# EAGLE board Arctos 65 V1 (EAGLE 9.6.2)
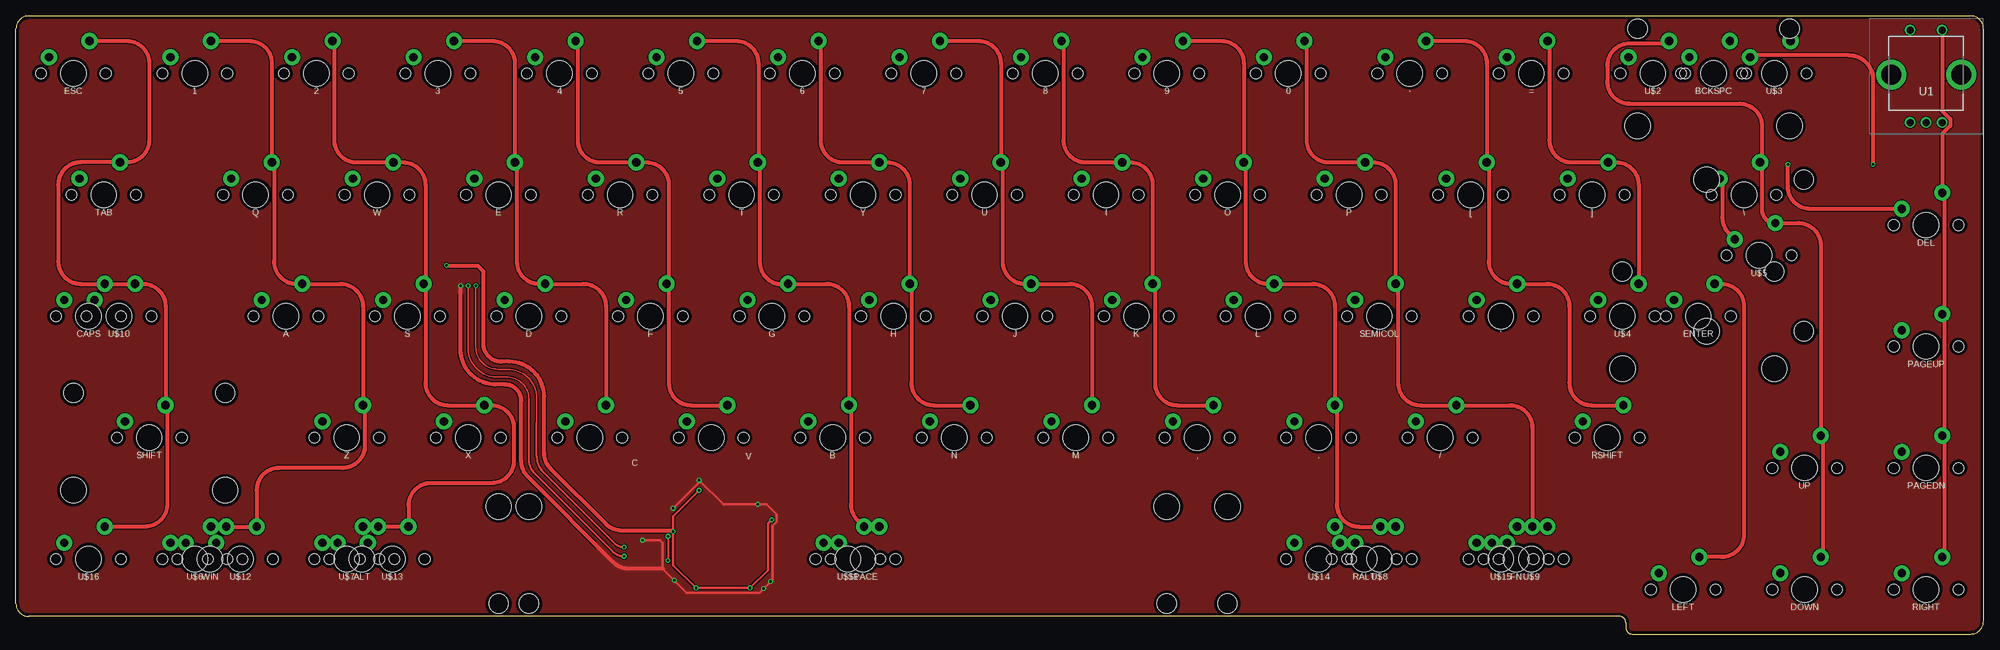
[diagram p2: board, top side]
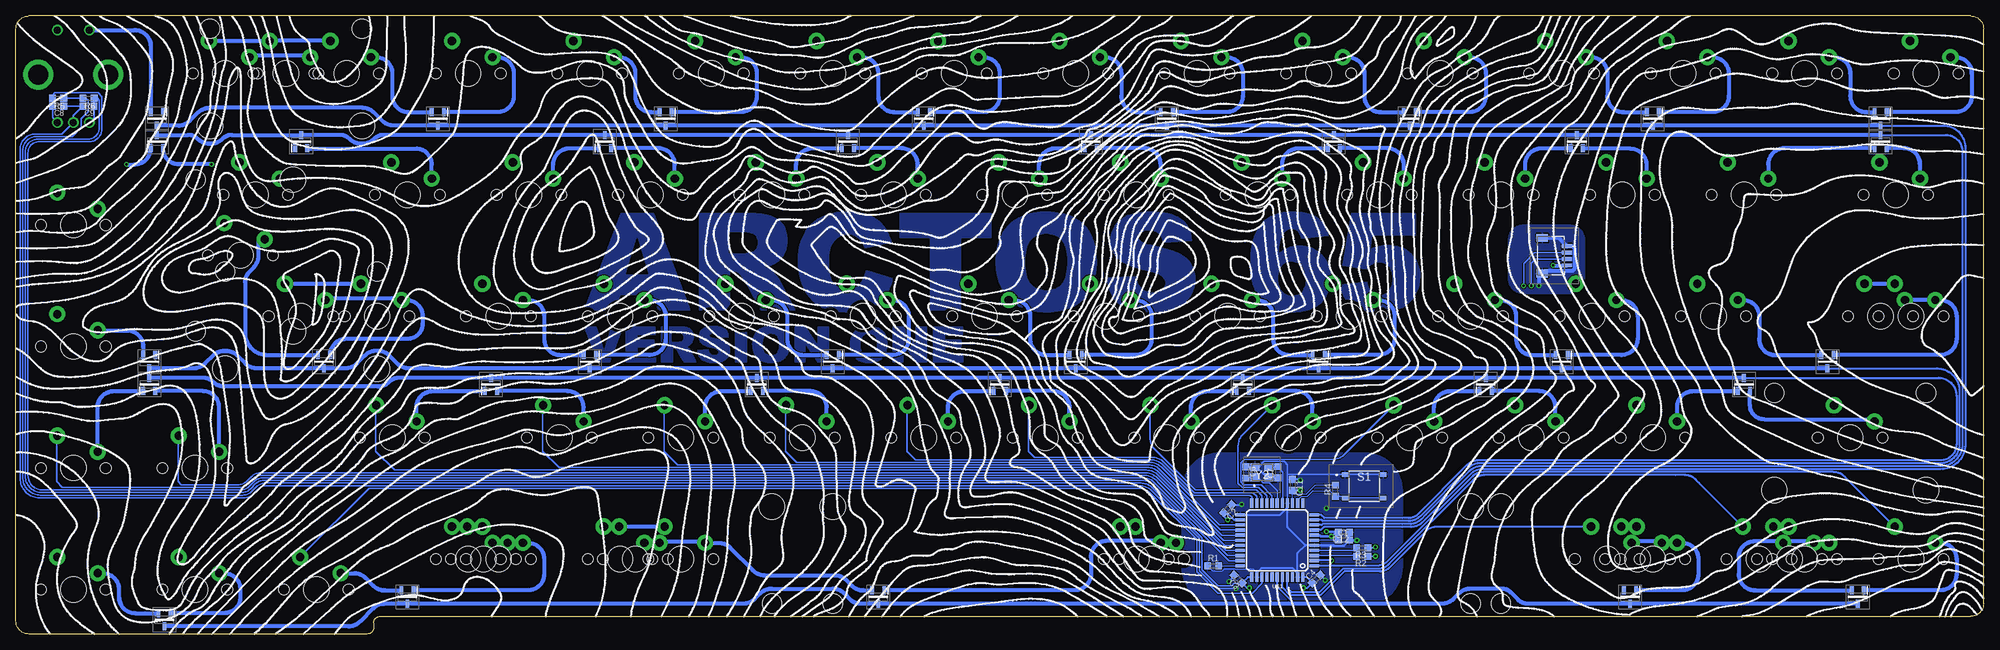
[diagram p3: board, bottom side, seen from below]

Size 308.51 x 96.96 mm. Coordinates in mm from the lower left corner, seen from the top.
Outline: 2,96.96 arc90 0,94.96
Outline: 308.51,94.96 arc90 306.51,96.96
Outline: 306.51,0 arc90 308.51,2
Outline: 0,4.76 arc90 2,2.76
Outline: 252.41,1.76 arc90 251.41,2.76
Outline: 252.41,1 arc90 253.41,0
Outline: 0,4.76 0,94.96
Outline: 308.51,2 308.51,94.96
Outline: 2,96.96 306.51,96.96
Outline: 2,96.96 arc90 0,94.96
Outline: 308.51,94.96 arc90 306.51,96.96
Outline: 251.41,2.76 2,2.76
Outline: 252.41,1.76 252.41,1
Outline: 306.51,0 arc90 308.51,2
Outline: 0,4.76 arc90 2,2.76
Outline: 252.41,1.76 arc90 251.41,2.76
Outline: 252.41,1 arc90 253.41,0
Outline: 253.41,0 306.51,0
Copper layers (1*16): Top 0.035mm / dielectric 1.5mm / Bottom 0.035mm
Design rules "default *": minimum track width 6mil, minimum drill 0.35mm, track to track 6mil, track to pad 6mil, pad to pad 6mil, via to via 6mil, smd to smd 6mil, copper to edge 20mil, drill to drill 6mil, minimum pad ring 10mil, minimum via ring 8mil, stop-mask expansion 4mil, vias tented up to drill 0mil, thermal gap 10mil

## Footprints (pad centres in the part's own frame; a part is rotated, then mirrored left to right if it is on the bottom)
MX-1U = drill 1.3 pad 2.54: MX1 -3.81,2.54; MX2 2.54,5.08 | hole 4: 0,0 | hole 1.7: -5.08,0; 5.08,0
MX-2U = drill 1.3 pad 2.54: MX1 -3.81,2.54; MX2 2.54,5.08 | hole 4: 0,0; -11.9,-8.24; 11.9,-8.24 | hole 1.7: -5.08,0; 5.08,0 | hole 3.05: -11.9,7; 11.9,7
C0603 = smd 1.05 x 1.08: 1 -0.875,0; 2 0.875,0
SOT96P237X111-3N = smd 1.25 x 0.6: 1 -1.05,0.955; 2 -1.05,-0.955; 3 1.05,0
1014760600004LF = smd 0.6 x 1.55: 1 -1.5,2; 2 -0.5,2; 3 0.5,2; 4 1.5,2 | smd 1.2 x 1.8: 5 -2.8,-1.875; 6 2.8,-1.875
R0603 = smd 1.05 x 1.08: 1 -0.875,0; 2 0.875,0
PTS526SM08SMTR2LFS = smd 1 x 0.7: 1 -3,1.85; 2 3,1.85; 3 -3,-1.85; 4 3,-1.85
MX-7U-FLIPPED = drill 1.3 pad 2.54: MX1 -3.81,2.54; MX2 2.54,5.08 | hole 4: 0,0; -57.15,8.24; 57.15,8.24 | hole 1.7: -5.08,0; 5.08,0 | hole 3.05: -57.15,-7; 57.15,-7
EC11E183440C = drill 1.1 pad 1.65: A1 0,0; B1 5,0; C1 2.5,0; D1 0,14.5; E1 5,14.5 | drill 3.139 pad 4.708: MH1 -3,7.5; MH2 8,7.5
TQFP44 = smd 1.5 x 0.5: 1 -5.8,4; 2 -5.8,3.2; 3 -5.8,2.4; 4 -5.8,1.6; 5 -5.8,0.8; 6 -5.8,0; 7 -5.8,-0.8; 8 -5.8,-1.6; 9 -5.8,-2.4; 10 -5.8,-3.2; 11 -5.8,-4; 23 5.8,-4; 24 5.8,-3.2; 25 5.8,-2.4; 26 5.8,-1.6; 27 5.8,-0.8; 28 5.8,0; 29 5.8,0.8; 30 5.8,1.6; 31 5.8,2.4; 32 5.8,3.2; 33 5.8,4 | smd 0.5 x 1.5: 12 -4,-5.8; 13 -3.2,-5.8; 14 -2.4,-5.8; 15 -1.6,-5.8; 16 -0.8,-5.8; 17 0,-5.8; 18 0.8,-5.8; 19 1.6,-5.8; 20 2.4,-5.8; 21 3.2,-5.8; 22 4,-5.8; 34 4,5.8; 35 3.2,5.8; 36 2.4,5.8; 37 1.6,5.8; 38 0.8,5.8; 39 0,5.8; 40 -0.8,5.8; 41 -1.6,5.8; 42 -2.4,5.8; 43 -3.2,5.8; 44 -4,5.8
MX-2U-ROTATED = drill 1.3 pad 2.54: MX1 -3.81,2.54; MX2 2.54,5.08 | hole 4: 0,0; -8.24,-11.9; -8.24,11.9 | hole 1.7: -5.08,0; 5.08,0 | hole 3.05: 7,-11.9; 7,11.9
MX-6.25U-FLIPPED = drill 1.3 pad 2.54: MX1 -3.81,2.54; MX2 2.54,5.08 | hole 4: 0,0; -50,8.24; 50,8.24 | hole 1.7: -5.08,0; 5.08,0 | hole 3.05: -50,-7; 50,-7
ABM8AIG16000MHZ81ZT = smd 1.4 x 1.2: 1 -1.1,-0.8; 2 1.1,-0.8; 3 1.1,0.8; 4 -1.1,0.8

## Placement (x,y rotation side)
0  KEYSWITCH-PLAIN-MX-1U  [MX-1U]  199.5,87.96 0 top
1  KEYSWITCH-PLAIN-MX-1U  [MX-1U]  28.05,87.96 0 top
2  KEYSWITCH-PLAIN-MX-1U  [MX-1U]  47.1,87.96 0 top
3  KEYSWITCH-PLAIN-MX-1U  [MX-1U]  66.15,87.96 0 top
4  KEYSWITCH-PLAIN-MX-1U  [MX-1U]  85.2,87.96 0 top
5  KEYSWITCH-PLAIN-MX-1U  [MX-1U]  104.25,87.96 0 top
6  KEYSWITCH-PLAIN-MX-1U  [MX-1U]  123.3,87.96 0 top
7  KEYSWITCH-PLAIN-MX-1U  [MX-1U]  142.35,87.96 0 top
8  KEYSWITCH-PLAIN-MX-1U  [MX-1U]  161.4,87.96 0 top
9  KEYSWITCH-PLAIN-MX-1U  [MX-1U]  180.45,87.96 0 top
'  KEYSWITCH-PLAIN-MX-1U  [MX-1U]  232.84,49.86 0 top
,  KEYSWITCH-PLAIN-MX-1U  [MX-1U]  185.21,30.81 0 top
-  KEYSWITCH-PLAIN-MX-1U  [MX-1U]  218.55,87.96 0 top
.  KEYSWITCH-PLAIN-MX-1U  [MX-1U]  204.26,30.81 0 top
/  KEYSWITCH-PLAIN-MX-1U  [MX-1U]  223.31,30.81 0 top
=  KEYSWITCH-PLAIN-MX-1U  [MX-1U]  237.6,87.96 0 top
[  KEYSWITCH-PLAIN-MX-1U  [MX-1U]  228.07,68.91 0 top
\  KEYSWITCH-PLAIN-MX-1U  [MX-1U]  270.94,68.91 0 top
]  KEYSWITCH-PLAIN-MX-1U  [MX-1U]  247.12,68.91 0 top
A  KEYSWITCH-PLAIN-MX-1U  [MX-1U]  42.34,49.86 0 top
ALT  KEYSWITCH-PLAIN-MX-1U  [MX-1U]  54.24,11.76 0 top
B  KEYSWITCH-PLAIN-MX-1U  [MX-1U]  128.06,30.81 0 top
BCKSPC  KEYSWITCH-PLAIN-MX-2U  [MX-2U]  266.18,87.96 0 top
C  KEYSWITCH-PLAIN-MX-1U  [MX-1U]  89.96,30.81 0 top
C1  1uF  [C0603]  100.28,14.73 180 bottom
C2  0.1uF  [C0603]  118.53,19.65 225 bottom
C3  0.1uF  [C0603]  116.9,8.61 315 bottom
C4  0.1uF  [C0603]  104.61,8.64 225 bottom
C6  12pF  [C0603]  115.64,25.35 90 bottom
C7  12pF  [C0603]  110.64,25.37 270 bottom
C8  10nF  [C0603]  301.9,82.78 0 bottom
C9  10nF  [C0603]  297.13,82.78 0 bottom
C11  0.1uF  [C0603]  108.35,23.39 270 bottom
C12  10uF  [C0603]  100.29,15.96 180 bottom
CAPS  KEYSWITCH-PLAIN-MX-1U  [MX-1U]  11.38,49.86 0 top
D  KEYSWITCH-PLAIN-MX-1U  [MX-1U]  80.44,49.86 0 top
D1  BAV199LT1G  [SOT96P237X111-3N]  16.14,80.82 270 bottom
D2  BAV199LT1G  [SOT96P237X111-3N]  16.14,77.25 90 bottom
D3  BAV199LT1G  [SOT96P237X111-3N]  24.48,42.72 270 bottom
D4  BAV199LT1G  [SOT96P237X111-3N]  37.58,39.15 90 bottom
D5  BAV199LT1G  [SOT96P237X111-3N]  78.06,39.15 90 bottom
D6  BAV199LT1G  [SOT96P237X111-3N]  116.16,39.15 90 bottom
D7  BAV199LT1G  [SOT96P237X111-3N]  154.26,39.15 90 bottom
D8  BAV199LT1G  [SOT96P237X111-3N]  192.36,39.15 90 bottom
D9  BAV199LT1G  [SOT96P237X111-3N]  234.03,39.15 90 bottom
D10  BAV199LT1G  [SOT96P237X111-3N]  287.61,39.15 90 bottom
D11  BAV199LT1G  [SOT96P237X111-3N]  19.72,5.81 270 bottom
D12  BAV199LT1G  [SOT96P237X111-3N]  55.43,5.81 270 bottom
D13  BAV199LT1G  [SOT96P237X111-3N]  173.31,5.81 270 bottom
D14  BAV199LT1G  [SOT96P237X111-3N]  247.12,5.81 270 bottom
D15  BAV199LT1G  [SOT96P237X111-3N]  66.15,42.72 270 bottom
D16  BAV199LT1G  [SOT96P237X111-3N]  104.25,42.72 270 bottom
D17  BAV199LT1G  [SOT96P237X111-3N]  142.35,42.72 270 bottom
D18  BAV199LT1G  [SOT96P237X111-3N]  180.45,42.72 270 bottom
D19  BAV199LT1G  [SOT96P237X111-3N]  218.55,42.72 270 bottom
D20  BAV199LT1G  [SOT96P237X111-3N]  260.22,42.72 270 bottom
D21  BAV199LT1G  [SOT96P237X111-3N]  287.61,42.72 270 bottom
D22  BAV199LT1G  [SOT96P237X111-3N]  63.77,77.25 90 bottom
D23  BAV199LT1G  [SOT96P237X111-3N]  101.87,77.25 90 bottom
D24  BAV199LT1G  [SOT96P237X111-3N]  139.97,77.25 90 bottom
D25  BAV199LT1G  [SOT96P237X111-3N]  178.07,77.25 90 bottom
D26  BAV199LT1G  [SOT96P237X111-3N]  216.17,77.25 90 bottom
D27  BAV199LT1G  [SOT96P237X111-3N]  263.79,77.25 90 bottom
D28  BAV199LT1G  [SOT96P237X111-3N]  286.42,77.25 90 bottom
D29  BAV199LT1G  [SOT96P237X111-3N]  51.86,80.82 270 bottom
D30  BAV199LT1G  [SOT96P237X111-3N]  89.96,80.82 270 bottom
D31  BAV199LT1G  [SOT96P237X111-3N]  128.06,80.82 270 bottom
D32  BAV199LT1G  [SOT96P237X111-3N]  166.16,80.82 270 bottom
D33  BAV199LT1G  [SOT96P237X111-3N]  206.64,80.82 270 bottom
D34  BAV199LT1G  [SOT96P237X111-3N]  242.36,80.82 270 bottom
D35  BAV199LT1G  [SOT96P237X111-3N]  286.42,80.82 270 bottom
D36  BAV199LT1G  [SOT96P237X111-3N]  285.22,2.24 270 bottom
DEL  KEYSWITCH-PLAIN-MX-1U  [MX-1U]  299.51,64.15 0 top
DOWN  KEYSWITCH-PLAIN-MX-1U  [MX-1U]  280.46,7 0 top
E  KEYSWITCH-PLAIN-MX-1U  [MX-1U]  75.67,68.91 0 top
ENTER  KEYSWITCH-PLAIN-MX-2U  [MX-2U]  263.79,49.86 0 top
ESC  KEYSWITCH-PLAIN-MX-1U  [MX-1U]  9,87.96 0 top
F  KEYSWITCH-PLAIN-MX-1U  [MX-1U]  99.49,49.86 0 top
FN  KEYSWITCH-PLAIN-MX-1U  [MX-1U]  235.22,11.76 0 top
G  KEYSWITCH-PLAIN-MX-1U  [MX-1U]  118.54,49.86 0 top
H  KEYSWITCH-PLAIN-MX-1U  [MX-1U]  137.59,49.86 0 top
I  KEYSWITCH-PLAIN-MX-1U  [MX-1U]  170.92,68.91 0 top
J  KEYSWITCH-PLAIN-MX-1U  [MX-1U]  156.64,49.86 0 top
J1  10147606-00004LF  [1014760600004LF]  67.32,59.34 270 bottom
K  KEYSWITCH-PLAIN-MX-1U  [MX-1U]  175.69,49.86 0 top
L  KEYSWITCH-PLAIN-MX-1U  [MX-1U]  194.74,49.86 0 top
LEFT  KEYSWITCH-PLAIN-MX-1U  [MX-1U]  261.41,7 0 top
M  KEYSWITCH-PLAIN-MX-1U  [MX-1U]  166.16,30.81 0 top
N  KEYSWITCH-PLAIN-MX-1U  [MX-1U]  147.11,30.81 0 top
O  KEYSWITCH-PLAIN-MX-1U  [MX-1U]  189.97,68.91 0 top
P  KEYSWITCH-PLAIN-MX-1U  [MX-1U]  209.02,68.91 0 top
PAGEDN  KEYSWITCH-PLAIN-MX-1U  [MX-1U]  299.51,26.05 0 top
PAGEUP  KEYSWITCH-PLAIN-MX-1U  [MX-1U]  299.51,45.1 0 top
Q  KEYSWITCH-PLAIN-MX-1U  [MX-1U]  37.58,68.91 0 top
R  KEYSWITCH-PLAIN-MX-1U  [MX-1U]  94.73,68.91 0 top
R1  10k  [R0603]  120.8,10.69 0 bottom
R2  22  [R0603]  97.4,12.19 180 bottom
R3  22  [R0603]  97.41,13.49 180 bottom
R4  10k  [R0603]  101.63,22.46 90 bottom
R5  10k  [R0603]  301.89,84.04 0 bottom
R6  10k  [R0603]  297.13,84.04 0 bottom
RALT  KEYSWITCH-PLAIN-MX-1U  [MX-1U]  211.41,11.76 0 top
RIGHT  KEYSWITCH-PLAIN-MX-1U  [MX-1U]  299.51,7 0 top
RSHIFT  KEYSWITCH-PLAIN-MX-1U  [MX-1U]  249.51,30.81 0 top
S  KEYSWITCH-PLAIN-MX-1U  [MX-1U]  61.39,49.86 0 top
S1  PTS526_SM08_SMTR2_LFS  [PTS526SM08SMTR2LFS]  97.14,23.18 0 bottom
SEMICOL  KEYSWITCH-PLAIN-MX-1U  [MX-1U]  213.79,49.86 0 top
SHIFT  KEYSWITCH-PLAIN-MX-2U  [MX-2U]  20.91,30.81 0 top
SPACE  KEYSWITCH-PLAIN-MX-7U-FLIPPED  [MX-7U-FLIPPED]  132.82,11.76 0 top
T  KEYSWITCH-PLAIN-MX-1U  [MX-1U]  113.78,68.91 0 top
TAB  KEYSWITCH-PLAIN-MX-1U  [MX-1U]  13.76,68.91 0 top
U  KEYSWITCH-PLAIN-MX-1U  [MX-1U]  151.88,68.91 0 top
U1  EC11E183440C  [EC11E183440C]  297.01,80.24 0 top
U$1  32U4  [TQFP44]  110.74,14.71 180 bottom
U$2  KEYSWITCH-PLAIN-MX-1U  [MX-1U]  256.65,87.96 0 top
U$3  KEYSWITCH-PLAIN-MX-1U  [MX-1U]  275.7,87.96 0 top
U$4  KEYSWITCH-PLAIN-MX-1U  [MX-1U]  251.89,49.86 0 top
U$5  KEYSWITCH-PLAIN-MX-2U-ROTATED  [MX-2U-ROTATED]  273.32,59.39 0 top
U$6  KEYSWITCH-PLAIN-MX-1U  [MX-1U]  28.05,11.76 0 top
U$7  KEYSWITCH-PLAIN-MX-1U  [MX-1U]  51.86,11.76 0 top
U$8  KEYSWITCH-PLAIN-MX-1U  [MX-1U]  213.79,11.76 0 top
U$9  KEYSWITCH-PLAIN-MX-1U  [MX-1U]  237.6,11.76 0 top
U$10  KEYSWITCH-PLAIN-MX-1U  [MX-1U]  16.14,49.86 0 top
U$11  KEYSWITCH-PLAIN-MX-6.25U-FLIPPED  [MX-6.25U-FLIPPED]  130.44,11.76 0 top
U$12  KEYSWITCH-PLAIN-MX-1U  [MX-1U]  35.19,11.76 0 top
U$13  KEYSWITCH-PLAIN-MX-1U  [MX-1U]  59.01,11.76 0 top
U$14  KEYSWITCH-PLAIN-MX-1U  [MX-1U]  204.26,11.76 0 top
U$15  KEYSWITCH-PLAIN-MX-1U  [MX-1U]  232.84,11.76 0 top
U$16  KEYSWITCH-PLAIN-MX-1U  [MX-1U]  11.38,11.76 0 top
UP  KEYSWITCH-PLAIN-MX-1U  [MX-1U]  280.46,26.05 0 top
V  KEYSWITCH-PLAIN-MX-1U  [MX-1U]  109.01,30.81 0 top
W  KEYSWITCH-PLAIN-MX-1U  [MX-1U]  56.62,68.91 0 top
WIN  KEYSWITCH-PLAIN-MX-1U  [MX-1U]  30.43,11.76 0 top
X  KEYSWITCH-PLAIN-MX-1U  [MX-1U]  70.91,30.81 0 top
Y  KEYSWITCH-PLAIN-MX-1U  [MX-1U]  132.82,68.91 0 top
Y2  ABM8AIG-16.000MHZ-8-1Z-T  [ABM8AIG16000MHZ81ZT]  113.14,25.36 0 bottom
Z  KEYSWITCH-PLAIN-MX-1U  [MX-1U]  51.86,30.81 0 top

## Tracks (layer width: path | path; a pad name or v marks a point on that pad's centre or on a via)
A1
  Bottom 0.2: U1.A1 296.26,81 C9.2 R6.2
  Bottom 0.254: 296.54,84.04 R6.2 295.72,84.04 295.44,83.76 295.44,79.44 arc90 297.25,77.62 305.15,77.62 arc-90 307.03,75.74 307.03,24.73 arc-90 304.5,22.19 273.13,22.19 arc-45 271.72,22.78 270.88,23.61 arc45 269.75,24.08 132.82,24.08 131.94,24.08 arc45 130.14,23.34 129.27,22.46 118.31,11.51 U$1.32
B1
  Bottom 0.152: 302.77,82.82 C8.1 302.77,83.18
  Bottom 0.2: U1.B1 302.77,81 C8.1 | R5.1 302.77,83.18
  Bottom 0.254: R5.1 302.77,84.53 302.41,84.89 295.65,84.89 295.04,84.28 295.04,79.27 arc90 297.09,77.22 304.96,77.22 arc-90 306.63,75.55 306.63,24.9 arc-90 304.33,22.6 273.33,22.6 arc-45 271.92,23.19 271.2,23.91 arc45 269.79,24.49 132.82,24.49 131.77,24.49 arc45 129.97,23.75 129.57,23.35 118.53,12.31 U$1.31 116.56,12.32
C0
  Top 0.61: SHIFT.MX2 23.45,51.44 arc90 19.95,54.94 U$10.MX2 CAPS.MX2 10.12,54.94 arc-90 6.62,58.44 6.62,70.49 arc-90 10.12,73.99 TAB.MX2 17.41,73.99 arc90 20.91,77.49 20.91,89.54 arc90 17.41,93.04 ESC.MX2 | SHIFT.MX2 23.79,35.89 | SHIFT.MX2 23.72,35.62 23.72,20.34 arc-90 20.22,16.84 U$16.MX2
  Bottom 0.305: U$16.MX2 20.83,23.75 21.73,24.65 arc-45 23.53,25.4 25.67,25.4 78.42,25.4 arc-45 80.21,24.65 93.41,11.46 arc45 95.2,10.72 U$1.1
  Bottom 0.61: CAPS.MX2 U$10.MX2
C1
  Top 0.61: 1.MX2 36.61,93.04 arc-90 40.11,89.54 Q.MX2 40.47,73.64 40.47,58.44 arc90 43.97,54.94 A.MX2 50.9,54.94 arc-90 54.4,51.44 Z.MX2 | Z.MX2 54.67,35.62 | Z.MX2 54.7,35.6 54.7,29.55 arc-90 51.2,26.05 41.23,26.05 arc90 37.73,22.55 U$12.MX2 WIN.MX2 U$6.MX2
  Bottom 0.305: U$12.MX2 44.64,23.75 45.09,24.2 arc-45 46.89,24.94 48.29,24.94 78.22,24.94 arc-45 80.01,24.2 93.21,11 arc45 95,10.26 100.42,10.26 104.14,6.54 108.56,6.54 109.14,7.13 109.14,8.88 109.16,8.9 U$1.41
C2
  Top 0.61: 2.MX2 49.91,92.77 49.91,77.49 arc90 53.41,73.99 W.MX2 60.7,73.99 arc-90 64.2,70.49 64.2,54.67 | S.MX2 64.2,54.67 | 64.2,54.67 64.2,39.39 arc90 67.7,35.89 X.MX2 74.56,35.89 arc-90 78.06,32.39 78.06,27.17 arc-90 74.56,23.67 65.05,23.67 arc90 61.55,20.17 U$13.MX2 ALT.MX2 U$7.MX2
  Bottom 0.305: U$13.MX2 85.67,16.84 arc-45 87.47,16.1 93.08,10.49 arc45 94.73,9.8 100.23,9.8 103.95,6.08 108.74,6.08 109.95,7.29 109.95,8.9 U$1.40
C3
  Top 0.61: 3.MX2 74.72,93.04 arc-90 78.22,89.54 E.MX2 78.53,73.68 78.53,58.44 arc90 82.03,54.94 D.MX2 89,54.94 arc-90 92.5,51.44 C.MX2
  Bottom 0.254: C.MX2 100.22,28.17 arc45 102.02,27.43 115.9,27.43 116.46,26.86 116.46,23.83 116.03,23.4 113.25,23.4 111.54,21.69 U$1.18
C4
  Top 0.61: 4.MX2 88.08,92.7 88.08,77.49 arc90 91.58,73.99 R.MX2 | R.MX2 97.55,73.71 | F.MX2 102.36,54.61 | R.MX2 98.86,73.99 arc-90 102.36,70.49 102.36,54.61 | V.MX2 105.86,35.89 arc-90 102.36,39.39 102.36,54.61
  Bottom 0.254: V.MX2 115.2,32.24 116.13,31.31 arc-45 116.88,29.52 116.88,28.43 116.88,23.67 116.2,22.99 113.67,22.99 112.34,21.65 U$1.19
C5
  Top 0.61: 107.17,92.67 5.MX2 112.9,93.04 arc-90 116.4,89.54 116.4,73.91 | T.MX2 116.4,73.91 | 116.4,73.91 116.63,73.67 116.63,58.36 arc90 120.13,54.86 121.16,54.86 | 121.16,54.86 G.MX2 127.1,54.94 arc-90 130.6,51.44 B.MX2 130.91,35.58 130.91,20.34 arc90 134.41,16.84 SPACE.MX2 | 121.16,54.86 121.44,54.58
  Bottom 0.254: B.MX2 130.7,35.8 130.7,30.77 arc-45 129.95,28.97 123.56,22.57 114.04,22.57 113.14,21.67 U$1.20 | U$1.20
  Bottom 0.61: U$11.MX2 SPACE.MX2
C6
  Top 0.61: 6.MX2 126.17,92.71 126.17,77.49 arc90 129.67,73.99 Y.MX2 136.63,73.99 arc-90 140.13,70.49 H.MX2 140.4,54.94 140.4,39.39 arc90 143.9,35.89 N.MX2
  Bottom 0.254: N.MX2 149.75,35.8 149.75,28.68 148.8,27.74 131.63,27.74 130.37,27.74 arc45 128.57,27 127.84,26.27 123.74,22.17 114.53,22.17 113.94,21.58 113.94,20.53 U$1.21
C7
  Top 0.61: 7.MX2 150.91,93.04 arc-90 154.41,89.54 U.MX2 154.69,73.99 154.69,58.44 arc90 158.19,54.94 J.MX2 165.2,54.94 arc-90 168.7,51.44 M.MX2
  Bottom 0.254: M.MX2 168.8,35.8 168.8,28.68 167.45,27.34 131.63,27.34 130.54,27.34 arc45 128.75,26.59 128.13,25.98 123.92,21.76 114.99,21.76 114.74,21.51 U$1.22
C8
  Top 0.61: 8.MX2 164.23,93.04 164.23,77.49 arc90 167.73,73.99 I.MX2 174.73,73.99 arc-90 178.23,70.49 K.MX2 178.59,54.94 178.59,39.39 arc90 182.09,35.89 ,.MX2
  Bottom 0.254: ,.MX2 187.85,35.8 187.85,28.68 186.09,26.93 131.63,26.93 130.72,26.93 arc45 128.92,26.19 127.83,25.09 119.84,17.1 U$1.25
C9
  Top 0.61: 9.MX2 189.01,93.04 arc-90 192.51,89.54 O.MX2 192.82,73.99 192.82,58.44 arc90 196.32,54.94 L.MX2 203.3,54.94 arc-90 206.8,51.44 ..MX2 207.11,35.89 207.11,20.34 arc90 210.61,16.84 RALT.MX2 U$8.MX2
  Bottom 0.254: ..MX2 206.9,35.8 206.9,28.68 204.74,26.52 130.9,26.52 arc45 129.1,25.78 119.64,16.32 116.55,16.32 U$1.26
  Bottom 0.61: U$14.MX2 RALT.MX2
C10
  Top 0.61: 0.MX2 202.36,93.04 202.36,77.49 arc90 205.86,73.99 P.MX2 212.83,73.99 arc-90 216.33,70.49 SEMICOL.MX2 216.72,54.94 216.72,39.39 arc90 220.22,35.89 /.MX2 234.26,35.89 arc-90 237.76,32.39 FN.MX2
  Bottom 0.254: /.MX2 225.95,35.8 225.95,28.68 223.38,26.12 131.07,26.12 arc45 129.27,25.37 119.41,15.51 U$1.27
  Bottom 0.61: U$15.MX2 FN.MX2 U$9.MX2
C11
  Top 0.61: -.MX2 227.11,93.04 arc-90 230.61,89.54 [.MX2 230.92,73.99 230.92,58.44 arc90 234.42,54.94 '.MX2 240.05,54.94 arc-90 243.55,51.44 243.55,39.39 arc90 247.05,35.89 RSHIFT.MX2
  Bottom 0.254: RSHIFT.MX2 252.14,35.8 252.14,28.68 249.17,25.71 132.82,25.71 131.24,25.71 arc45 129.44,24.97 129.29,24.82 119.19,14.71 U$1.28
C12
  Top 0.61: =.MX2 240.42,93.04 240.42,77.49 arc90 243.92,73.99 ].MX2 250.93,73.99 arc-90 254.43,70.49 U$4.MX2 | ENTER.MX2 267.44,54.94 arc-90 270.94,51.44 270.94,15.58 arc-90 267.44,12.08 LEFT.MX2
  Bottom 0.254: LEFT.MX2 253.17,22.87 134.02,22.87 132.47,22.87 arc45 130.67,22.12 130.14,21.59 123.37,14.81 123.37,9.77 120.02,6.42 114.64,6.42 113.14,7.92 U$1.36
  Bottom 0.61: U$4.MX2 ENTER.MX2
C13
  Top 0.61: DOWN.MX2 283.27,12.35 283.27,30.86 UP.MX2 283,60.97 arc90 279.5,64.47 U$5.MX2 arc-90 273.76,66.56 273.76,73.71 | \.MX2 273.76,73.71 | U$2.MX2 258.77,92.62 253.01,92.62 arc90 249.51,89.12 249.51,86.7 arc90 253.01,83.2 270.26,83.2 arc-90 273.76,79.7 273.76,73.71
  Bottom 0.254: UP.MX2 283.1,31.03 283.1,23.92 282.59,23.41 273.68,23.41 arc-45 272.27,24 271.55,24.72 arc45 270.13,25.3 132.82,25.3 131.42,25.3 arc45 129.63,24.56 128.99,23.93 118.99,13.93 116.56,13.93 U$1.29
  Bottom 0.61: U$2.MX2 BCKSPC.MX2 U$3.MX2
C15
  Top 0.61: U1.E1 302.01,82.06 303.29,80.78 303.29,79.71 302.05,78.47 DEL.MX2 302.32,68.96 302.32,50.45 PAGEUP.MX2 302.32,49.91 302.32,31.4 PAGEDN.MX2 302.32,30.86 302.32,12.35 RIGHT.MX2
  Bottom 0.254: PAGEDN.MX2 302.15,31.03 302.15,23.92 301.23,23.01 273.51,23.01 arc-45 272.1,23.59 271.38,24.31 arc45 269.96,24.9 132.82,24.9 131.6,24.9 arc45 129.8,24.15 129.28,23.64 118.76,13.11 U$1.30 116.56,13.12
D+
  Bottom 0.152: 104.93,13.12 U$1.4
  Bottom 0.254: U$1.4 98.67,13.11 R3.2
D-
  Bottom 0.152: 104.93,12.32 U$1.3
  Bottom 0.254: U$1.3 98.4,12.31 R2.2
GND  (via drill 0.35, 0.35 pad 0.55)
  Top 0.406: v98.28,14.72 101.03,14.72 101.42,14.32 101.42,10.26 101.42,10.22 v103.22,8.42 105.15,6.49 116.59,6.49 v117.22,7.12 v118.32,8.22 118.62,8.52 118.62,16.99 119.25,17.62 119.25,18.79 117.72,20.32 v116.32,20.32 110.92,20.32 v107.12,24.12 107.12,23.82 103.03,19.74 v103.02,19.74
  Top 0.61: 101.42,10.26 96.13,10.26 arc-45 93.65,11.28 80.27,24.66 arc-45 79.25,27.14 79.25,36.57 arc90 76.67,39.15 75.2,39.15 arc-90 69.72,44.63 v69.72,54.62
  Bottom 0.152: U$1.15 | R1.1 120.91,9.92 119.3,9.92 118.99,10.23 114.55,10.23 113.94,9.62 | 109.08,19.92 109.14,19.92
  Bottom 0.2: C6.2 115.58,26.16 Y2.4 113.96,26.16 | C7.2 110.71,24.56 Y2.2 112.36,24.56 113.96,26.16 | U$1.15 109.15,20.52 109.15,24.97 | 109.15,24.97 109.15,26.56 109.64,27.04 112.81,27.04 113.7,26.16 113.96,26.16 | S1.2 S1.1 109.1,25.03 109.15,24.97 | C8.2 | C8.2 C9.1 | C9.1
  Bottom 0.254: C9.1 299.51,81.28 U1.C1 301.32,78.44 305.5,78.44 arc-90 307.85,76.09 307.85,24.39 arc-90 304.84,21.38 272.71,21.38 arc-45 271.29,21.97 270.57,22.69 arc45 269.16,23.27 132.29,23.27 arc45 130.49,22.53 122.95,14.98 122.95,9.93 120.18,7.16 117.26,7.16 v117.22,7.12
  Bottom 0.305: C4.1 104.12,9.26 | U$1.35 113.94,9.62 113.24,10.32 108.32,10.32 107.54,9.55 U$1.43 107.54,12.7 106.32,13.92 | 117.91,20.08 C2.1 116.38,20.27 v116.32,20.32 | v107.12,24.12 107.26,24.27 C11.1 | v118.32,8.22 117.52,9.03 C3.1 | 109.14,19.88 110.31,18.71 U$1.23 | 109.14,19.88 109.14,19.92 U$1.15 | U$1.5 106.31,13.91 106.32,13.92 | 109.14,19.88 109.14,16.75 106.32,13.92
  Bottom 0.406: v98.28,14.72 99.39,14.72 C1.1 | U$1.5 101.91,13.91 101.83,13.83 100.3,13.83 C1.1 | C1.1 C12.1 | v103.22,8.42 104.05,9.26 104.12,9.26
  Bottom 0.61: v69.72,54.62 69.73,54.64 69.73,56 J1.6 68.73,57.01 64.43,57.01 64.09,57.35 64.09,60.47 64.45,60.83 J1.1 66.62,62.14 J1.5
  pour Bottom: 107.82,4.62 119.73,4.62 arc90 125.68,10.57 125.68,22.48 arc90 119.73,28.43 97.11,28.43 arc90 91.15,22.48 91.15,10.57 arc90 97.11,4.62
  pour Top: 111.39,4.62 119.73,4.62 arc90 125.68,10.57 125.68,22.48 arc90 119.73,28.43 97.11,28.43 arc90 91.15,22.48 91.15,10.57 arc90 97.11,4.62
  pour Top: 62.58,59.39 62.58,61.77 arc-90 64.96,64.15 70.91,64.15 72.1,64.15 arc-90 74.48,61.77 74.48,58.2 74.48,55.82 arc-90 72.1,53.43 64.96,53.43 arc-90 62.58,55.82
  pour Bottom: 62.58,58.2 62.58,61.77 arc-90 64.96,64.15 72.1,64.15 arc-90 74.48,61.77 74.48,55.82 arc-90 72.1,53.43 64.96,53.43 arc-90 62.58,55.82
N$1  (via drill 0.35)
  Top 0.61: DEL.MX1 281.34,66.69 arc-90 277.84,70.19 v277.84,73.68
  Bottom 0.61: v277.84,73.68 282.95,73.68 arc90 D28.2
N$2
  Bottom 0.61: A.MX1 37.73,52.4 arc90 35.19,49.86 35.19,46.31 arc-90 32.65,43.77 D3.2
N$3
  Bottom 0.61: D20.1 arc90 256.75,46.29 247.12,46.29 arc-90 244.74,48.67 244.74,49.86 arc-90 247.28,52.4 U$4.MX1 248.35,52.68 259.71,52.68 ENTER.MX1
N$4
  Bottom 0.61: U$6.MX1 WIN.MX1 26.91,14.59 31.09,14.59 U$12.MX1 32.07,14.3 32.35,14.58 35.85,14.58 arc-90 38.39,12.04 38.39,9.4 arc-90 35.85,6.86 D11.2
N$5
  Bottom 0.61: U$13.MX1 54.91,14.59 50.72,14.59 ALT.MX1 U$7.MX1 47.26,14.3 arc90 44.72,11.76 44.72,9.4 arc90 47.26,6.86 D12.1
N$6
  Bottom 0.61: U$8.MX1 RALT.MX1 207.32,14.57 200.72,14.57 U$14.MX1 198.33,14.3 arc45 196.53,13.56 192.94,9.96 arc-45 191.14,9.22 180.15,9.22 arc45 178.35,8.47 177.48,7.6 arc-45 175.69,6.86 D13.2
N$7
  Bottom 0.61: U$9.MX1 FN.MX1 U$15.MX1 228.23,14.3 arc90 225.69,11.76 225.69,9.4 arc90 228.23,6.86 D14.1
N$8
  Bottom 0.61: U$16.MX1 6.78,14.3 arc90 4.24,11.76 4.24,9.4 arc90 6.78,6.86 D11.1
N$9
  Bottom 0.61: ESC.MX1 4.4,90.5 arc90 1.86,87.96 1.86,84.41 arc90 4.4,81.87 D1.1
N$10
  Bottom 0.61: 1.MX1 23.45,90.5 arc90 20.91,87.96 20.91,84.41 arc-90 18.37,81.87 D1.2
N$11
  Bottom 0.61: TAB.MX1 9.95,73.66 arc-90 12.49,76.2 D2.2
N$12
  Bottom 0.61: D2.1 31.22,76.2 arc-90 33.77,73.66 Q.MX1
N$13
  Bottom 0.61: 2.MX1 42.5,90.5 arc90 39.96,87.96 39.96,84.41 arc90 42.5,81.87 D29.1
N$14
  Bottom 0.61: 3.MX1 61.55,90.5 arc90 59.01,87.96 59.01,84.41 arc-90 56.47,81.87 D29.2
N$15
  cutout Bottom: 212.8,56.57 209.47,56.57 211.14,62.02
N$16
  pour Bottom: 208.53,65.95 202.84,50.8 207.74,50.8 208.5,53.3 213.82,53.3 214.56,50.8 219.34,50.8 213.64,65.95
N$17
  Bottom 0.61: 4.MX1 80.6,90.5 arc90 78.06,87.96 78.06,84.41 arc90 80.6,81.87 D30.1
N$18
  Bottom 0.61: 5.MX1 99.65,90.5 arc90 97.11,87.96 97.11,84.41 arc-90 94.57,81.87 D30.2
N$19
  Bottom 0.61: 6.MX1 118.7,90.5 arc90 116.16,87.96 116.16,84.39 arc90 118.68,81.87 D31.1
N$20
  Bottom 0.61: 7.MX1 137.75,90.5 arc90 135.21,87.96 135.21,84.41 arc-90 132.67,81.87 D31.2
N$21
  Bottom 0.61: 8.MX1 156.8,90.5 arc90 154.26,87.96 154.26,84.41 arc90 156.8,81.87 D32.1
N$22
  Bottom 0.61: 9.MX1 175.85,90.5 arc90 173.31,87.96 173.31,84.41 arc-90 170.77,81.87 D32.2
N$23
  Bottom 0.61: 0.MX1 194.9,90.5 arc90 192.36,87.96 192.36,84.41 arc90 194.9,81.87 D33.1
N$24
  Bottom 0.61: -.MX1 213.95,90.5 arc90 211.41,87.96 211.41,84.41 arc-90 208.87,81.87 D33.2
N$25
  Bottom 0.61: =.MX1 233,90.5 arc90 230.46,87.96 230.46,84.41 arc90 233,81.87 D34.1
N$26
  Bottom 0.61: U$2.MX1 252.05,90.5 arc90 249.51,87.96 249.51,84.41 arc-90 246.97,81.87 D34.2
N$27
  Bottom 0.508: 62.81,76.11 D22.2
  Bottom 0.61: W.MX1 52.81,73.57 arc-90 55.36,76.11 62.81,76.11
N$28
  Bottom 0.61: E.MX1 71.87,73.66 arc90 69.33,76.2 D22.1
N$29
  Bottom 0.61: R.MX1 90.92,73.66 arc-90 93.45,76.2 D23.2
N$30
  Bottom 0.61: T.MX1 109.97,73.66 arc90 107.42,76.2 D23.1
N$31
  Bottom 0.61: Y.MX1 129.01,73.66 arc-90 131.55,76.2 D24.2
N$32
  Bottom 0.61: U.MX1 148.06,73.66 arc90 145.52,76.2 D24.1
N$33
  Bottom 0.61: I.MX1 167.11,73.66 arc-90 169.66,76.2 D25.2
N$34
  Bottom 0.61: O.MX1 186.16,73.66 arc90 183.62,76.2 D25.1
N$35
  Bottom 0.61: P.MX1 205.21,73.66 arc-90 207.75,76.2 D26.2
N$36
  Bottom 0.61: [.MX1 224.26,73.66 arc90 221.72,76.2 D26.1
N$37
  Bottom 0.61: ].MX1 243.31,73.66 arc-90 245.8,76.14 262.78,76.14 D27.2
N$38
  pour Bottom: 155.63,65.95 155.63,62.21 160.4,62.21 160.4,50.8 165.09,50.8 165.09,62.21 169.86,62.21 169.86,65.95
N$39
  pour Bottom: 215.09,48.17 213.37,48.17 215.41,42.68 217.25,42.68 219.32,48.17 217.55,48.17 216.31,44.22
N$40
  Bottom 0.61: S.MX1 56.78,52.4 arc90 54.24,49.86 54.24,46.31 arc90 56.78,43.77 D15.1
N$41
  Bottom 0.61: U1.D1 289.91,94.74 arc90 287.37,92.2 D35.2
N$42
  Bottom 0.61: D.MX1 75.83,52.4 arc90 73.29,49.86 73.29,46.31 arc-90 70.75,43.77 D15.2
N$43
  Bottom 0.61: F.MX1 94.88,52.4 arc90 92.34,49.86 92.34,46.31 arc90 94.88,43.77 D16.1
N$44
  Bottom 0.61: U$10.MX1 CAPS.MX1 6.78,52.4 arc90 4.24,49.86 4.24,46.31 arc90 6.78,43.77 D3.1
N$45
  Bottom 0.61: G.MX1 113.93,52.4 arc90 111.39,49.86 111.39,46.31 arc-90 108.85,43.77 D16.2
N$46
  Bottom 0.61: H.MX1 132.98,52.4 arc90 130.44,49.86 130.44,46.31 arc90 132.98,43.77 D17.1
N$47
  Bottom 0.61: J.MX1 152.03,52.4 arc90 149.49,49.86 149.49,46.31 arc-90 146.95,43.77 D17.2
N$48
  Bottom 0.61: K.MX1 171.08,52.4 arc90 168.54,49.86 168.54,46.31 arc90 171.08,43.77 D18.1
N$49
  Bottom 0.61: L.MX1 190.13,52.4 arc90 187.59,49.86 187.59,46.31 arc-90 185.05,43.77 D18.2
N$50
  Bottom 0.61: SEMICOL.MX1 209.18,52.4 arc90 206.64,49.86 206.64,46.31 arc90 209.18,43.77 D19.1
N$51
  Bottom 0.61: '.MX1 228.23,52.4 arc90 225.69,49.86 225.69,46.31 arc-90 223.15,43.77 D19.2
N$52
  Top 0.61: \.MX1 267.54,71.04 267.54,65.34 arc45 268.56,62.87 U$5.MX1
  Bottom 0.61: U$5.MX1 270.44,61.93 270.51,61.86 270.51,59.39 arc45 271.33,57.4 271.93,56.8 arc-45 272.59,55.19 272.59,47.27 arc-90 269.09,43.77 D20.2
N$53
  Bottom 0.61: SHIFT.MX1 17.41,33.67 34.39,33.67 arc90 36.62,35.89 D4.2
N$54
  Bottom 0.61: Z.MX1 48.05,35.56 arc90 45.51,38.1 D4.1
N$55
  Bottom 0.61: X.MX1 67.1,35.56 arc-90 69.64,38.1 D5.2
N$56
  Bottom 0.61: C.MX1 86.15,35.56 arc90 83.61,38.1 D5.1
N$57
  Bottom 0.61: V.MX1 105.2,35.56 arc-90 107.74,38.1 D6.2
N$58
  Bottom 0.61: B.MX1 124.25,35.56 arc90 121.71,38.1 D6.1
N$59
  Bottom 0.61: N.MX1 143.3,35.56 arc-90 145.84,38.1 D7.2
N$60
  Bottom 0.61: M.MX1 162.35,35.56 arc90 159.81,38.1 D7.1
N$61
  Bottom 0.61: ,.MX1 181.4,35.56 arc-90 183.94,38.1 D8.2
N$62
  Bottom 0.61: ..MX1 200.45,35.56 arc90 197.91,38.1 D8.1
N$63
  Bottom 0.61: /.MX1 219.5,35.56 arc-90 222.04,38.1 D9.2
N$64
  Bottom 0.61: RSHIFT.MX1 245.7,35.56 arc90 243.16,38.1 D9.1
N$65
  Bottom 0.61: UP.MX1 276.65,35.56 arc-90 279.19,38.1 D10.2
N$66  (via drill 0.35)
  Top 0.254: 81.63,33.19 81.63,37.05 arc90 77.15,41.53 75.6,41.53 arc-90 72.1,45.03 v72.1,54.62
  Top 0.305: 81.63,33.19 81.63,27.91 arc45 82.65,25.43 93.82,14.27 arc45 v95.37,13.62
  Bottom 0.254: R3.1 95.51,13.49 v95.37,13.62 | v72.1,54.62 72.1,58.14 70.4,59.84 J1.2
N$67
  Bottom 0.152: R1.2 116.56,10.69 U$1.33
N$68  (via drill 0.35)
  Top 0.254: 80.44,36.84 arc90 76.94,40.34 75.34,40.34 arc-90 70.91,44.76 v70.91,54.62
  Top 0.305: 80.44,36.84 80.44,27.5 arc45 81.46,25.02 93.53,12.96 arc45 v95.36,12.2
  Bottom 0.254: R2.1 v95.35,12.19 v95.36,12.2 | v70.91,54.62 70.91,58.16 70.23,58.84 J1.3
N$69
  pour Bottom: 212.82,42.68 208.19,42.68 208.19,43.92 211.12,43.92 211.12,45.01 208.47,45.01 208.47,46.13 211.12,46.13 211.12,47 208.27,47 208.27,48.17 212.82,48.17
N$70
  Bottom 0.152: C1.2 101.18,14.71 U$1.6
N$71
  Bottom 0.152: 110.72,20.53 U$1.17
  Bottom 0.2: C6.1 115.55,24.56 Y2.1 113.76,24.56 112.91,23.71 111.96,23.71 110.72,22.47 110.72,20.53
N$72  (via drill 0.35)
  Top 0.61: U$3.MX1 272.18,90.79 287.39,90.79 arc-90 291.18,87 v291.18,73.67
  Bottom 0.61: U$3.MX1 271.62,90.77 262.64,90.77 BCKSPC.MX1 | v291.18,73.67 289.89,73.67 arc-90 D28.1
N$73
  pour Bottom: 193.99,48.17 193.99,42.68 195.69,42.68 195.69,48.17
N$74
  Bottom 0.61: PAGEUP.MX1 291.1,47.64 arc90 288.56,45.1 D21.2
N$75
  Bottom 0.61: PAGEDN.MX1 295.7,35.56 arc90 293.16,38.1 D10.1
N$76
  Bottom 0.61: U$11.MX1 SPACE.MX1 129.33,14.62 137.43,14.62 arc-90 139.97,12.08 139.97,9.4 arc90 142.51,6.86 D13.1
N$77
  Bottom 0.61: 256.81,9.54 LEFT.MX1 255.46,9.54 arc45 253.7,8.81 252.49,7.6 arc-45 250.69,6.86 D14.2 248.08,7
N$78
  Bottom 0.61: DOWN.MX1 275.86,9.54 arc90 273.32,7 273.32,5.81 arc90 275.84,3.29 D36.1
N$79
  Bottom 0.61: RIGHT.MX1 294.91,9.54 arc90 292.37,7 292.37,5.81 arc-90 289.85,3.29 D36.2
N$80
  Bottom 0.2: Y2.3 110.72,26.16 110.7,26.19 | 110.7,26.19 C7.1 | U$1.16 109.94,21.34 109.83,21.46 109.83,25.32 110.7,26.19
N$81
  Bottom 0.152: 107.62,20.59 U$1.13 107.59,20.55 107.59,20.99 106.99,21.58 106.03,21.58 105.16,22.45 102.49,22.45 R4.1 101.38,21.33
  Bottom 0.2: S1.4 S1.3 100.39,21.58 R4.1
N$82
  pour Bottom: 181.11,48.17 181.11,42.68 182.71,42.68 184.77,45.7 184.77,42.68 186.37,42.68 186.37,48.17 184.78,48.17 182.71,45.13 182.71,48.17
N$83
  pour Bottom: 167.37,42.68 165.77,42.68 165.77,48.17 167.37,48.17 167.37,45.13 169.44,48.17 171.02,48.17 171.02,42.68 169.42,42.68 169.42,45.7
N$84
  pour Bottom: 164.64,42.68 160.01,42.68 160.01,43.92 162.94,43.92 162.94,45.01 160.3,45.01 160.3,46.13 162.94,46.13 162.94,47 160.09,47 160.09,48.17 164.64,48.17
N$85
  cutout Bottom: 143.81,59.07 143.8,58.55 143.81,57.94 143.85,57.37 143.92,56.86 144.01,56.4 144.12,55.98 144.27,55.61 144.43,55.29 144.63,55.02 144.84,54.79 145.08,54.59 145.34,54.42 145.62,54.29 145.93,54.18 146.25,54.1 146.6,54.06 146.96,54.04 147.32,54.06 147.66,54.1 147.98,54.18 148.28,54.29 148.56,54.43 148.82,54.61 149.06,54.81 149.28,55.04 149.48,55.31 149.66,55.63 149.8,55.98 149.92,56.37 150.02,56.8 150.08,57.27 150.12,57.79 150.14,58.34 150.12,58.9 150.08,59.42 150.02,59.89 149.92,60.33 149.8,60.72 149.65,61.08 149.48,61.39 149.28,61.66 149.06,61.89 148.82,62.1 148.56,62.27 148.28,62.41 147.99,62.52 147.68,62.6 147.35,62.65 147.01,62.66 146.65,62.65 146.3,62.6 145.98,62.52 145.68,62.42 145.4,62.28 145.13,62.11 144.89,61.91 144.66,61.68 144.46,61.41 144.29,61.11 144.14,60.77 144.02,60.4 143.92,59.99 143.85,59.55
N$86
  pour Bottom: 139.12,58.36 139.12,58.47 139.12,58.6 139.14,59.16 139.18,59.7 139.25,60.21 139.34,60.71 139.46,61.19 139.6,61.65 139.76,62.09 139.96,62.51 140.17,62.91 140.42,63.28 140.68,63.64 140.98,63.98 141.29,64.3 141.63,64.6 141.99,64.87 142.37,65.11 142.78,65.33 143.2,65.53 143.65,65.7 144.11,65.85 144.6,65.97 145.11,66.06 145.64,66.14 146.19,66.18 146.76,66.21 147.34,66.2 147.89,66.18 148.43,66.12 148.94,66.04 149.44,65.94 149.91,65.81 150.37,65.66 150.8,65.48 151.22,65.27 151.62,65.05 151.99,64.79 152.35,64.51 152.69,64.2 153,63.88 153.29,63.53 153.56,63.16 153.8,62.77 154.01,62.36 154.2,61.93 154.37,61.48 154.5,61.01 154.62,60.52 154.71,60.01 154.77,59.48 154.81,58.93 154.82,58.36 154.75,57.09 154.56,55.93 154.23,54.88 153.78,53.94 153.21,53.11 152.57,52.41 151.85,51.82 151.05,51.35 150.26,51.03 149.38,50.79 148.42,50.63 147.37,50.55 146.26,50.55 145.22,50.64 144.26,50.83 143.39,51.11 142.6,51.48 141.8,52 141.1,52.62 140.51,53.33 140.01,54.13 139.75,54.68 139.54,55.29 139.37,55.93 139.24,56.63 139.16,57.37 139.12,58.16
N$87
  cutout Bottom: 106.45,55.05 106.41,55.46 106.41,55.9 106.45,56.31 106.52,56.69 106.63,57.03 106.78,57.34 106.96,57.6 107.18,57.82 107.41,58 107.65,58.14 107.92,58.24 108.2,58.29 108.5,58.3 108.8,58.27 109.08,58.2 109.35,58.08 109.59,57.93 109.82,57.73 110.02,57.5 110.19,57.23 110.32,56.92 110.42,56.58 110.47,56.2 110.49,55.79 110.47,55.37 110.41,54.98 110.32,54.63 110.18,54.31 110,54.02 109.79,53.77 109.55,53.56 109.3,53.4 109.03,53.27 108.74,53.2 108.43,53.16 108.14,53.17 107.86,53.22 107.61,53.31 107.37,53.44 107.15,53.61 106.94,53.82 106.77,54.07 106.63,54.36 106.52,54.69
N$88
  cutout Bottom: 173.65,45.62 173.65,45.33 173.67,45.04 173.7,44.78 173.76,44.56 173.84,44.38 173.93,44.23 174.04,44.11 174.17,44.01 174.31,43.94 174.47,43.89 174.65,43.86 174.84,43.86 175.02,43.87 175.18,43.91 175.33,43.98 175.47,44.06 175.59,44.17 175.7,44.31 175.78,44.47 175.85,44.66 175.9,44.88 175.93,45.13 175.94,45.41 175.93,45.7 175.9,45.95 175.85,46.17 175.78,46.37 175.7,46.53 175.59,46.66 175.47,46.77 175.33,46.86 175.18,46.92 175.02,46.96 174.85,46.98 174.67,46.97 174.49,46.95 174.33,46.9 174.19,46.82 174.06,46.73 173.94,46.61 173.84,46.46 173.77,46.29 173.71,46.1 173.67,45.87
N$89
  pour Bottom: 171.96,45.83 171.95,45.4 171.96,45.08 171.99,44.78 172.05,44.49 172.12,44.24 172.22,44 172.33,43.78 172.46,43.58 172.61,43.4 172.78,43.23 172.96,43.08 173.16,42.95 173.39,42.84 173.62,42.75 173.88,42.67 174.16,42.62 174.45,42.59 174.77,42.59 175.08,42.6 175.38,42.63 175.65,42.67 175.91,42.74 176.14,42.82 176.36,42.92 176.56,43.05 176.74,43.19 176.92,43.36 177.08,43.54 177.22,43.75 177.35,43.98 177.45,44.23 177.53,44.5 177.59,44.79 177.63,45.09 177.64,45.42 177.62,45.88 177.55,46.29 177.43,46.67 177.27,47.02 177.06,47.32 176.81,47.59 176.52,47.82 176.19,48 175.82,48.13 175.42,48.22 174.99,48.26 174.52,48.26 174.08,48.21 173.68,48.11 173.32,47.97 173,47.79 172.71,47.56 172.47,47.28 172.28,46.97 172.13,46.63 172.02,46.25
N$90
  cutout Bottom: 189.01,45.04 188.99,45.33 188.99,45.62 189.01,45.87 189.05,46.1 189.11,46.29 189.19,46.46 189.29,46.61 189.41,46.73 189.54,46.82 189.68,46.9 189.84,46.95 190.01,46.97 190.2,46.98 190.37,46.96 190.53,46.92 190.68,46.86 190.81,46.77 190.93,46.66 191.04,46.53 191.13,46.37 191.2,46.17 191.25,45.95 191.28,45.7 191.29,45.41 191.28,45.13 191.25,44.88 191.2,44.66 191.13,44.47 191.04,44.31 190.94,44.17 190.81,44.06 190.68,43.98 190.53,43.91 190.36,43.87 190.18,43.86 190,43.86 189.82,43.89 189.66,43.94 189.52,44.01 189.39,44.11 189.28,44.23 189.18,44.38 189.11,44.56 189.05,44.78
N$91
  pour Bottom: 187.31,45.08 187.29,45.4 187.31,45.83 187.37,46.25 187.47,46.63 187.62,46.97 187.82,47.28 188.06,47.56 188.34,47.79 188.67,47.97 189.03,48.11 189.43,48.21 189.87,48.26 190.33,48.26 190.77,48.22 191.17,48.13 191.54,48 191.86,47.82 192.16,47.59 192.41,47.32 192.62,47.02 192.78,46.67 192.89,46.29 192.96,45.88 192.99,45.42 192.97,45.09 192.94,44.79 192.88,44.5 192.8,44.23 192.69,43.98 192.57,43.75 192.42,43.54 192.26,43.36 192.09,43.19 191.9,43.05 191.7,42.92 191.49,42.82 191.25,42.74 191,42.67 190.72,42.63 190.43,42.6 190.11,42.59 189.8,42.59 189.51,42.62 189.23,42.67 188.97,42.75 188.73,42.84 188.51,42.95 188.31,43.08 188.12,43.23 187.96,43.4 187.81,43.58 187.68,43.78 187.56,44 187.47,44.24 187.4,44.49 187.34,44.78
N$92
  cutout Bottom: 204,46.56 204,46.48 204,46.42 204.02,46.36 204.04,46.3 204.06,46.25 204.1,46.2 204.14,46.15 204.18,46.11 204.23,46.08 204.28,46.05 204.33,46.03 204.41,46.02 204.52,45.99 204.61,45.97 204.69,45.96 204.76,45.95 204.81,45.95 204.85,45.95 205.54,45.95 205.54,47.06 204.8,47.06 204.68,47.06 204.54,47.05 204.41,47.03 204.31,47 204.22,46.96 204.16,46.91 204.1,46.86 204.06,46.8 204.03,46.72 204.01,46.65
N$93
  pour Bottom: 188.61,55.11 186.38,50.8 191.67,50.8 194.17,55.42 194.18,55.43 194.48,55.96 194.76,56.35 195.02,56.59 195.38,56.79 195.76,56.91 196.17,56.95 196.58,56.95 196.58,50.8 201.29,50.8 201.29,65.95 193.48,65.95 192.46,65.93 191.57,65.86 190.8,65.74 190.16,65.58 189.62,65.35 189.13,65.05 188.69,64.66 188.31,64.2 188.04,63.73 187.83,63.22 187.69,62.66 187.62,62.06 187.62,61.47 187.67,60.94 187.78,60.45 187.94,59.99 188.15,59.57 188.55,58.99 189.05,58.5 189.63,58.08 190.08,57.86 190.63,57.66 191.27,57.48 190.77,57.3 190.36,57.11 190.05,56.92 189.86,56.75 189.61,56.49 189.3,56.13 189.01,55.75 188.79,55.44
N$94
  pour Bottom: 123.73,56.53 123.67,56 123.67,55.41 123.75,54.78 123.91,54.18 124.15,53.6 124.47,53.04 124.91,52.46 125.44,51.96 126.04,51.53 126.72,51.17 127.1,51.02 127.49,50.89 127.91,50.79 128.36,50.7 128.83,50.63 129.32,50.58 129.83,50.55 130.37,50.54 131.3,50.56 132.16,50.63 132.94,50.75 133.64,50.91 134.28,51.12 134.83,51.37 135.32,51.68 135.73,52.03 136.08,52.41 136.39,52.82 136.66,53.26 136.89,53.72 137.08,54.2 137.23,54.71 137.34,55.25 137.41,55.81 132.96,56.09 132.83,55.42 132.63,54.87 132.37,54.43 132.02,54.07 131.6,53.8 131.13,53.62 130.59,53.53 130.08,53.52 129.68,53.57 129.33,53.66 129.02,53.8 128.75,53.98 128.54,54.2 128.38,54.43 128.27,54.68 128.22,54.94 128.22,55.2 128.27,55.45 128.37,55.69 128.52,55.92 128.73,56.13 129.07,56.36 129.59,56.58 130.27,56.8 131.13,57.01 131.87,57.19 132.56,57.38 133.19,57.59 133.77,57.81 134.29,58.05 134.75,58.3 135.16,58.57 135.52,58.85 135.83,59.14 136.1,59.46 136.33,59.8 136.51,60.15 136.66,60.53 136.76,60.92 136.82,61.34 136.84,61.77 136.8,62.35 136.67,62.91 136.46,63.45 136.17,63.98 135.79,64.47 135.32,64.91 134.77,65.29 134.13,65.61 133.77,65.75 133.39,65.87 132.97,65.98 132.52,66.06 132.04,66.12 131.52,66.17 130.98,66.2 130.4,66.21 129.7,66.19 129.04,66.14 128.42,66.06 127.84,65.94 127.31,65.79 126.82,65.6 126.38,65.38 125.97,65.13 125.61,64.84 125.29,64.51 125,64.14 124.76,63.73 124.55,63.28 124.38,62.79 124.25,62.26 124.16,61.69 128.57,61.43 128.73,62.05 128.98,62.55 129.31,62.92 129.58,63.1 129.9,63.24 130.25,63.33 130.65,63.38 131.04,63.38 131.37,63.35 131.65,63.28 131.89,63.18 132.1,63.04 132.26,62.88 132.38,62.7 132.47,62.51 132.51,62.12 132.41,61.82 132.17,61.55 131.95,61.4 131.61,61.26 131.16,61.12 130.6,60.99 129.86,60.82 129.17,60.66 128.54,60.49 127.96,60.32 127.44,60.15 126.97,59.99 126.56,59.82 126.2,59.65 125.58,59.29 125.05,58.89 124.62,58.45 124.27,57.97 124.03,57.51 123.85,57.03
N$95
  pour Bottom: 88.4,56.65 88.38,56.14 88.43,55.41 88.56,54.7 88.79,54 89.11,53.32 89.51,52.68 89.99,52.12 90.55,51.65 91.18,51.25 91.81,50.97 92.52,50.76 93.3,50.62 94.15,50.55 94.93,50.54 95.56,50.57 96.14,50.62 96.68,50.71 97.17,50.82 97.85,51.04 98.46,51.32 98.99,51.67 99.46,52.06 99.87,52.49 100.21,52.95 100.5,53.46 100.76,54.05 100.98,54.72 96.73,55.19 96.72,55.19 96.57,54.56 96.33,54.04 96,53.63 95.74,53.42 95.45,53.26 95.15,53.16 94.82,53.11 94.45,53.11 94.09,53.17 93.76,53.31 93.46,53.5 93.19,53.77 92.97,54.1 92.8,54.49 92.68,54.95 92.63,55.47 92.63,56.05 92.68,56.58 92.8,57.04 92.97,57.43 93.2,57.74 93.47,57.99 93.79,58.18 94.14,58.3 94.53,58.36 94.87,58.37 95.14,58.34 95.4,58.28 95.66,58.19 95.92,58.07 96.21,57.89 96.52,57.63 96.85,57.29 100.43,57.8 99.1,65.95 89.1,65.95 89.1,62.59 95.88,62.59 96.24,60.32 95.77,60.52 95.31,60.68 94.85,60.81 94.16,60.94 93.49,60.98 92.93,60.96 92.4,60.89 91.9,60.78 91.43,60.63 90.98,60.44 90.56,60.2 90.16,59.92 89.8,59.6 89.47,59.25 89.18,58.87 88.93,58.47 88.74,58.05 88.58,57.61 88.47,57.14
N$96
  pour Bottom: 202.58,44.09 201.85,42.68 201.85,42.68 203.76,42.68 203.94,43.01 204.67,44.36 204.85,44.65 205.03,44.81 205.41,44.91 205.54,44.91 205.54,42.68 205.9,42.68 207.25,42.68 207.25,48.17 207.25,48.17 204.43,48.17 204.08,48.17 203.7,48.14 203.31,48.06 203.01,47.95 202.71,47.73 202.47,47.42 202.37,47.17 202.31,46.9 202.29,46.61 202.34,46.23 202.46,45.9 202.66,45.62 202.91,45.4 203.23,45.22 203.62,45.1 203.62,45.1 203.25,44.95 202.97,44.7 202.75,44.4
N$99
  pour Bottom: 196.62,44.65 196.61,44.45 196.63,44.22 196.68,43.99 196.75,43.77 196.86,43.56 197,43.36 197.16,43.19 197.34,43.03 197.55,42.9 197.78,42.79 198.04,42.7 198.33,42.64 198.64,42.6 198.98,42.59 199.25,42.59 199.54,42.6 199.81,42.63 200.06,42.68 200.28,42.74 200.49,42.81 200.67,42.89 200.83,42.99 200.97,43.1 201.08,43.23 201.19,43.36 201.28,43.5 201.37,43.65 201.44,43.8 201.5,43.96 201.54,44.13 201.58,44.31 201.6,44.5 199.98,44.6 199.93,44.34 199.83,44.08 199.75,43.97 199.61,43.84 199.46,43.75 199.28,43.69 198.98,43.67 198.76,43.69 198.52,43.79 198.36,43.94 198.27,44.12 198.27,44.32 198.34,44.49 198.5,44.65 198.64,44.73 198.82,44.8 199.06,44.87 199.31,44.93 199.37,44.94 199.61,45 199.84,45.07 200.05,45.14 200.24,45.21 200.41,45.28 200.57,45.37 200.72,45.45 200.95,45.63 201.14,45.84 201.27,46.07 201.35,46.32 201.39,46.59 201.39,46.71 201.37,46.9 201.33,47.08 201.26,47.26 201.16,47.44 201.04,47.6 200.89,47.75 200.72,47.88 200.53,47.99 200.3,48.09 200.05,48.17 199.75,48.22 199.41,48.26 199.23,48.26 199.04,48.27 198.81,48.26 198.59,48.25 198.39,48.22 198.19,48.18 198.01,48.14 197.85,48.08 197.69,48.02 197.55,47.94 197.42,47.85 197.3,47.76 197.2,47.65 197.11,47.53 197.02,47.39 196.95,47.25 196.89,47.09 196.85,46.92 196.79,46.63 198.38,46.54 198.39,46.54 198.47,46.8 198.61,47.02 198.8,47.16 199.07,47.23 199.35,47.24 199.56,47.19 199.71,47.09 199.79,46.95 199.82,46.8 199.79,46.69 199.65,46.54 199.42,46.45 199.14,46.38 198.97,46.34 198.74,46.29 198.52,46.23 198.32,46.18 198.14,46.12 197.97,46.07 197.81,46.01 197.56,45.9 197.35,45.78 197.17,45.66 197.01,45.52 196.89,45.36 196.79,45.2 196.71,45.03 196.66,44.84
N$100
  pour Bottom: 175.17,57 171.07,55.76 171.31,54.93 171.6,54.17 171.96,53.49 172.37,52.87 172.84,52.33 173.37,51.86 173.95,51.46 174.58,51.13 175.2,50.89 175.89,50.72 176.66,50.6 177.49,50.54 178.47,50.55 179.48,50.62 180.4,50.76 181.23,50.97 181.97,51.25 182.73,51.68 183.43,52.25 184.08,52.94 184.68,53.78 184.94,54.25 185.17,54.75 185.37,55.28 185.53,55.84 185.65,56.44 185.74,57.06 185.79,57.72 185.81,58.41 185.78,59.32 185.69,60.18 185.53,60.98 185.31,61.73 185.03,62.43 184.69,63.07 184.28,63.66 183.81,64.19 183.29,64.66 182.71,65.07 182.08,65.42 181.4,65.7 180.66,65.92 179.88,66.08 179.04,66.18 178.15,66.21 177.46,66.19 176.8,66.14 176.18,66.05 175.59,65.92 175.05,65.76 174.55,65.56 174.08,65.32 173.65,65.05 173.25,64.74 172.88,64.39 172.54,64.01 172.22,63.58 171.93,63.12 171.67,62.62 171.43,62.07 171.22,61.49 175.35,60.57 175.5,60.99 175.65,61.33 175.81,61.59 176.09,61.92 176.41,62.19 176.77,62.41 177.37,62.63 178.04,62.7 178.42,62.68 178.79,62.62 179.13,62.52 179.44,62.38 179.74,62.2 180.01,61.98 180.25,61.72 180.48,61.42 180.63,61.17 180.76,60.88 180.87,60.56 180.96,60.2 181.03,59.81 181.08,59.39 181.11,58.93 181.12,58.44 181.11,57.83 181.07,57.28 181.01,56.77 180.93,56.32 180.82,55.91 180.69,55.55 180.53,55.24 180.35,54.99 179.98,54.62 179.55,54.34 179.06,54.16 178.5,54.06 177.91,54.06 177.38,54.14 176.91,54.28 176.51,54.51 176.17,54.81 175.85,55.23 175.58,55.73 175.35,56.32
N$101
  pour Bottom: 102.44,56.33 102.42,55.79 102.46,55.05 102.6,54.35 102.82,53.69 103.13,53.05 103.52,52.47 103.97,51.96 104.5,51.53 105.09,51.17 105.68,50.92 106.33,50.73 107.05,50.61 107.83,50.54 108.73,50.55 109.66,50.62 110.49,50.78 111.23,51.01 111.89,51.31 112.38,51.64 112.84,52.02 113.26,52.48 113.64,53 113.98,53.58 114.14,53.9 114.28,54.23 114.41,54.58 114.52,54.96 114.62,55.35 114.7,55.76 114.77,56.2 114.83,56.65 114.87,57.12 114.89,57.61 114.91,58.12 114.91,58.32 114.91,58.42 114.9,58.79 114.87,59.52 114.8,60.2 114.7,60.85 114.58,61.46 114.42,62.03 114.23,62.56 114.02,63.05 113.77,63.51 113.49,63.92 113.18,64.3 112.73,64.75 112.23,65.14 111.7,65.46 111.12,65.73 110.5,65.94 109.84,66.09 109.14,66.18 108.39,66.21 107.95,66.2 107.54,66.18 107.14,66.15 106.78,66.1 106.43,66.04 106.11,65.97 105.81,65.89 105.54,65.79 104.88,65.47 104.3,65.06 103.79,64.56 103.37,63.98 103.02,63.31 102.74,62.54 106.93,62.02 107.06,62.55 107.25,62.96 107.48,63.26 107.66,63.41 107.86,63.51 108.08,63.58 108.31,63.62 108.66,63.61 109.07,63.51 109.43,63.3 109.75,63 110.03,62.59 110.13,62.38 110.22,62.11 110.31,61.79 110.39,61.42 110.46,61 110.53,60.52 110.59,59.99 110.64,59.41 110.13,59.87 109.61,60.25 109.09,60.54 108.67,60.7 108.23,60.81 107.75,60.88 107.25,60.91 106.75,60.88 106.27,60.81 105.82,60.7 105.38,60.54 104.96,60.34 104.56,60.09 104.18,59.8 103.82,59.46 103.49,59.08 103.21,58.69 102.97,58.26 102.77,57.82 102.62,57.35 102.51,56.85
N$102
  cutout Bottom: 192.32,61.55 192.31,61.37 192.33,61.13 192.39,60.9 192.48,60.69 192.61,60.49 192.77,60.32 192.95,60.18 193.15,60.08 193.37,60.02 193.59,59.97 193.79,59.93 193.97,59.89 194.14,59.86 194.41,59.82 194.61,59.81 196.58,59.81 196.58,62.89 194.66,62.89 194.37,62.89 194.22,62.88 193.94,62.87 193.68,62.83 193.45,62.79 193.24,62.74 192.98,62.63 192.78,62.5 192.58,62.28 192.43,62.02 192.38,61.87 192.34,61.72
N$107
  pour Top: 0,94.96 0,4.76 arc90 2,2.76 251.41,2.76 arc-90 252.41,1.76 252.41,1 arc90 253.41,0 306.51,0 arc90 308.51,2 308.51,94.96 arc90 306.51,96.96 2,96.96 arc90
R0
  Bottom 0.305: D1.3 6.36,79.77 arc90 2.86,76.27 2.86,29.75 arc90 6.75,25.86 78.61,25.86 arc-45 80.4,25.11 87.09,18.42 87.96,17.55 arc45 89.76,16.81 91.15,16.81 103.41,16.81 103.91,16.31 U$1.8
  Bottom 0.61: D1.3 D29.3 D30.3 D31.3 D32.3 D33.3 D34.3 249.29,79.77 arc45 251.09,80.51 252.37,81.79 arc-45 254.16,82.53 278.19,82.53 arc-45 279.98,81.79 281.26,80.51 arc45 283.06,79.77 D35.3
R1
  Bottom 0.305: D2.3 5.92,78.3 arc90 3.32,75.69 3.32,29.76 arc90 6.76,26.32 78.79,26.32 arc-45 80.59,25.57 87.42,18.74 88.15,18.01 arc45 89.95,17.27 91.15,17.27 103.62,17.27 103.78,17.11 U$1.9
  Bottom 0.61: D2.3 D22.3 D23.3 D24.3 D25.3 D26.3 250.86,78.3 arc-45 252.33,77.69 252.37,77.65 arc45 254.16,76.91 254.39,76.91 arc45 256.18,77.65 arc-45 257.74,78.3 D27.3 274.65,78.3 arc-45 276.14,77.68 276.17,77.65 arc45 277.96,76.91 278.19,76.91 arc45 279.98,77.65 arc-45 281.54,78.3 D28.3
R2
  Bottom 0.305: D3.3 7.28,41.67 arc90 3.78,38.17 3.78,29.78 arc90 6.77,26.78 78.98,26.78 arc-45 80.78,26.04 88.34,18.48 arc45 90.14,17.74 103.59,17.74 103.77,17.91 U$1.10
  Bottom 0.61: D3.3 D15.3 D16.3 D17.3 D18.3 D19.3 246.91,41.67 arc45 248.71,42.41 249.99,43.69 arc-45 251.78,44.43 252.01,44.43 arc-45 253.8,43.69 255.08,42.41 arc45 256.88,41.67 D20.3 270.71,41.67 arc45 272.51,42.41 273.78,43.69 arc-45 275.58,44.43 275.81,44.43 arc-45 277.6,43.69 278.88,42.41 arc45 280.68,41.67 D21.3
R3
  Bottom 0.305: D4.3 7.1,40.2 arc90 4.24,37.33 4.24,29.78 arc90 6.78,27.24 79.18,27.24 arc-45 80.97,26.5 88.67,18.8 arc45 90.12,18.2 91.15,18.2 103.36,18.2 103.87,18.71 | U$1.11 103.87,18.71 | 103.87,18.71
  Bottom 0.61: D4.3 D5.3 D6.3 D7.3 D8.3 D9.3 248.48,40.2 arc-45 249.95,39.59 249.99,39.55 arc45 251.78,38.81 275.81,38.81 arc45 277.6,39.55 277.64,39.59 arc-45 279.1,40.2 D10.3
R4
  Bottom 0.305: D12.3 | 108.07,4.76 110.74,7.43 U$1.39
  Bottom 0.61: 190.01,7.1 190.11,7.1 | 252.33,4.17 252.49,4.01 | 83.12,5.5 82.27,6.36 arc45 80.48,7.1 75.53,7.1 arc45 74.12,6.51 72.95,5.34 arc-45 71.54,4.76 D12.3 D11.3 | 83.12,5.5 83.27,5.36 | 190.01,7.1 180.41,7.1 arc45 178.62,6.36 177.62,5.36 arc-45 176.17,4.76 D13.3 110.2,4.76 108.07,4.76 84.92,4.76 arc-45 83.12,5.5 | 190.01,7.1 arc-45 191.81,6.36 192.66,5.5 arc45 194.46,4.76 D14.3 250.69,4.76 | 250.92,4.76 250.69,4.76 | 250.69,4.76 arc-45 252.49,4.01 | 252.49,4.01 254.57,1.93 arc45 256.37,1.19 D36.3
VCC  (via drill 0.35)
  Top 0.305: v102.25,15.33 102.25,11.56 v102.22,11.52
  Top 0.406: v107.12,22.52 103.04,18.45 v103.04,16.06 103.04,10.8 v106.62,7.22 v115.12,7.22 117.92,10.02 117.92,17.32 v118.52,17.92
  Top 0.61: v103.04,16.06 102.88,16.22 94.99,16.22 arc-45 92.52,17.25 83.84,25.92 arc-45 82.82,28.39 82.82,37.29 arc90 77.39,42.72 76.16,42.72 arc-90 73.29,45.58 73.29,56.9 72.44,57.75 67.59,57.75 v67.49,57.86
  Bottom 0.152: U$1.14 108.35,20.52 108.35,22.16 | 108.35,22.16 C11.2 | C2.2 119.43,19.03 | 108.35,22.16 108.1,21.91 106.23,21.91 104.81,23.33 R4.2
  Bottom 0.2: R5.2 R6.1
  Bottom 0.203: C11.2 | R5.2 301.02,84.51
  Bottom 0.254: R6.1 297.97,84 297.47,84 297.2,83.73 297.2,81.92 298.25,80.87 298.25,79.5 299.72,78.03 305.32,78.03 arc-90 307.44,75.91 307.44,24.56 arc-90 304.67,21.79 272.95,21.79 arc-45 271.54,22.37 270.82,23.09 arc45 269.41,23.68 132.12,23.68 arc45 130.32,22.93 122.52,15.13 122.52,10.07 120.01,7.57 117.87,7.57 117.5,7.93 116.22,7.93
  Bottom 0.305: U$1.44 106.12,8.91 C4.2 106.03,7.22 v106.62,7.22 | U$1.34 115.37,8.91 C3.2 116.22,7.93 115.51,7.22 v115.12,7.22 | v107.12,22.52 C11.2 | U$1.24 117.51,17.91 118.63,19.03 C2.2 | v102.22,11.52 104.93,11.52 U$1.2
  Bottom 0.406: v103.04,16.06 101.27,16.06 C12.2 101.29,16.09 101.41,16.09 102.17,15.33 v102.25,15.33 103.89,15.33 104.07,15.51 U$1.7 | C2.2 119.15,18.56 v118.52,17.92
  Bottom 0.61: J1.4 65.38,57.78 67.42,57.78 v67.49,57.86